# EAGLE design MB85RC1MT (EAGLE 9.6.2)
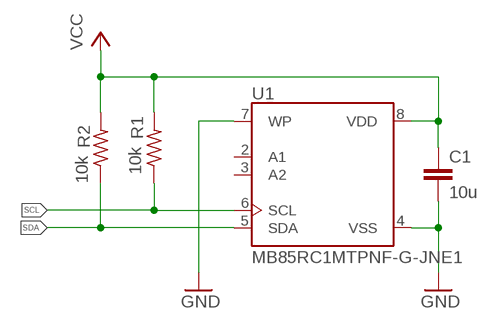
[diagram p0: schematic, sheet 1]

## Parts
C1  10u  C-EUC0603  [C0603]
R1  10k  R-US_R0603  [R0603]
R2  10k  R-US_R0603  [R0603]
U1  MB85RC1MTPNF-G-JNE1  [SOIC127P620X175-8N]

## Nets
GND: C1.2 U1.4(VSS) U1.7(WP)
SCL: R1.1 U1.6(SCL)
SDA: R2.1 U1.5(SDA)
VCC: C1.1 R1.2 R2.2 U1.8(VDD)
Unconnected: U1.2(A1) U1.3(A2)

## Library data of the parts
C1 = rcl:C-EU: CAPACITOR, European symbol; SPICEPREFIX: C
R1 R2 = rcl:R-US_: RESISTOR, American symbol; SPICEPREFIX: R
U1 = MB85RC1MTPNF-G-JNE1:MB85RC1MTPNF-G-JNE1: Fujitsu MB85RC1MTPNF-G-JNE1 1M Bit FRAM LSI I2C Serial Interface Check prices <https://pricing.snapeda.com/parts/MB85RC1MTPNF-G-JNE1/Fujitsu/view-part?ref=eda>; AVAILABILITY: Bad; DESCRIPTION: F-RAM 1Mbit FRAM, I2C, BULK; MF: Fujitsu; MP: MB85RC1MTPNF-G-JNE1; PACKAGE: None; PRICE: None

## Board
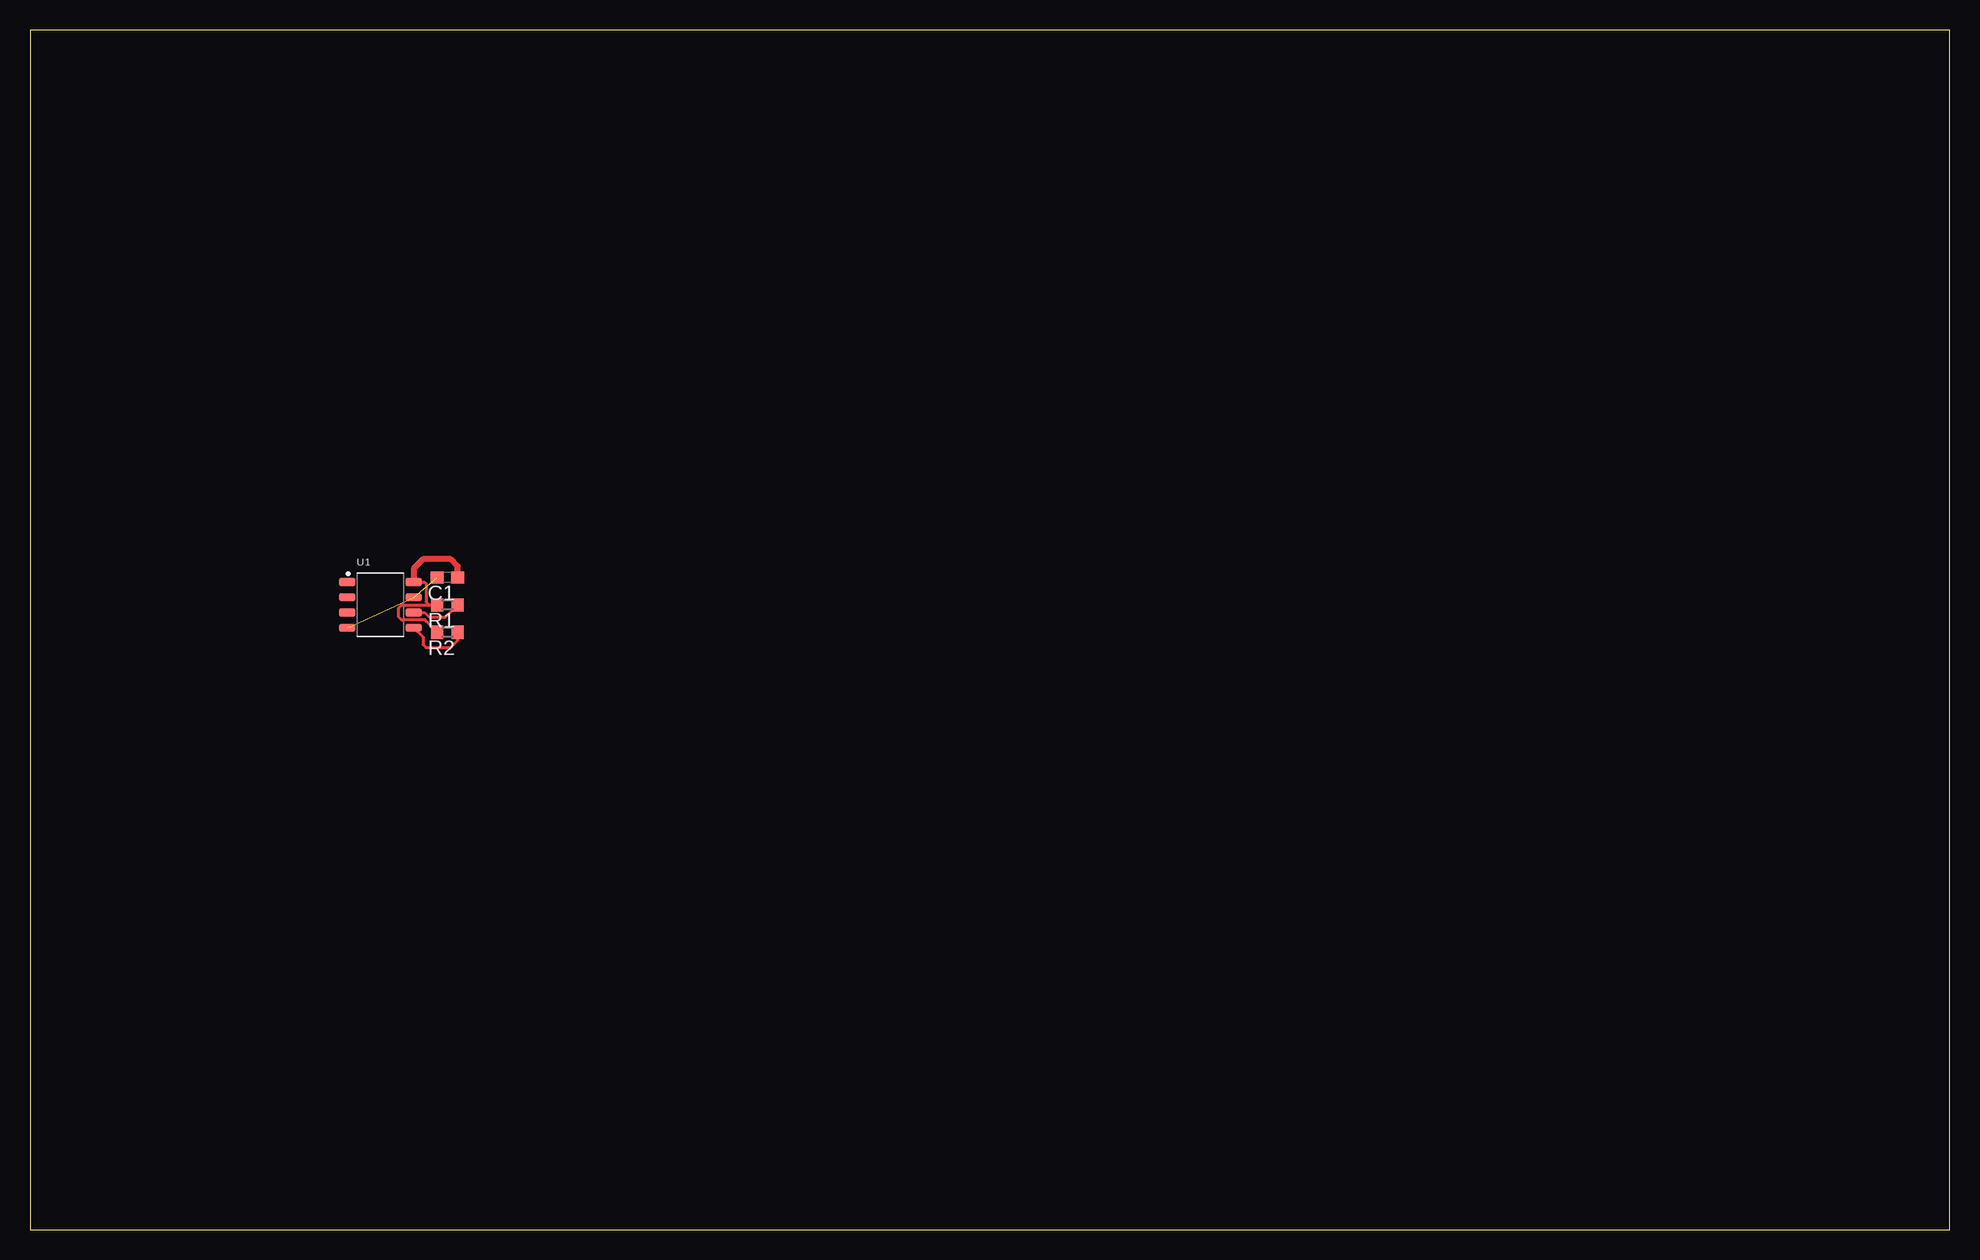
[diagram p1: board, top side]

Size 160 x 100 mm. Coordinates in mm from the lower left corner, seen from the top.
Outline: 0,0 160,0 160,100 0,100 0,0
Copper layers (1*16): Top 0.035mm / dielectric 1.5mm / Bottom 0.035mm
Design rules "default": minimum track width 6mil, minimum drill 0.35mm, track to track 6mil, track to pad 6mil, pad to pad 6mil, via to via 6mil, smd to smd 6mil, copper to edge 40mil, drill to drill 6mil, minimum pad ring 10mil, minimum via ring 8mil, stop-mask expansion 4mil, vias tented up to drill 0mil, thermal gap 10mil

### Footprints (pad centres in the part's own frame; a part is rotated, then mirrored left to right if it is on the bottom)
C0603 = smd 1.1 x 1: 1 -0.85,0; 2 0.85,0
R0603 = smd 1 x 1.1: 1 -0.85,0; 2 0.85,0
SOIC127P620X175-8N = smd 1.36 x 0.66: 1 -2.78,1.905; 2 -2.78,0.635; 3 -2.78,-0.635; 4 -2.78,-1.905; 5 2.78,-1.905; 6 2.78,-0.635; 7 2.78,0.635; 8 2.78,1.905

### Placement (x,y rotation side)
C1  34.8,54.36 180 top
R1  34.8,52.07 180 top
R2  34.8,49.78 180 top
U1  29.21,52.07 0 top

### Tracks (layer width: path | path; a pad name or v marks a point on that pad's centre or on a via)
GND  (2 unrouted)
SCL
  Top 0.254: U1.6 32.89,51.44 33.27,51.05 34.63,51.05 R1.1
SDA
  Top 0.254: U1.5 32.77,49.39 32.77,48.77 33.02,48.51 35.05,48.51 35.65,49.11 R2.1
VCC
  Top 0.254: U1.8 32.89,53.98 33.02,53.85 33.02,52.32 33.27,52.07 | 33.27,52.07 33.53,52.07 R1.2 | R2.2 33.02,50.71 33.02,50.73 32.95,50.8 30.99,50.8 30.73,51.05 30.73,51.82 30.99,52.07 33.27,52.07
  Top 0.305: 33.95,52.41 R1.2
  Top 0.406: 32.38,53.98 U1.8
  Top 0.508: C1.1 35.65,55.28 35.05,55.88 32.77,55.88 31.99,55.1 U1.8